# EAGLE design audiopthboard (EAGLE 5.06)
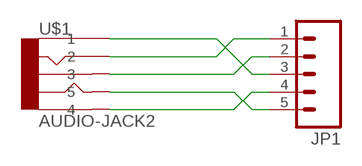
[diagram p0: schematic, sheet 1]

## Parts
JP1  M05LOCK  [1X05_LOCK]
U$1  AUDIO-JACK2  [AUDIO-JACK]

## Nets
N$1: JP1.1 U$1.2
N$2: JP1.2 U$1.3
N$3: JP1.3 U$1.1
N$4: JP1.5 U$1.5
N$5: JP1.4 U$1.4

## Library data of the parts
JP1 = SparkFun:M05: Header 5 Standard 5-pin 0.1" header. Use with straight break away headers (SKU : PRT-00116), right angle break away headers (PRT-00553), swiss pins (PRT-00743), machine pins (PRT-00117), and female headers (PRT-00115). Molex polarized connector foot print use with SKU : PRT-08230 with associated crimp pins and housings.
U$1 = SparkFun:AUDIO-JACK2

## Board
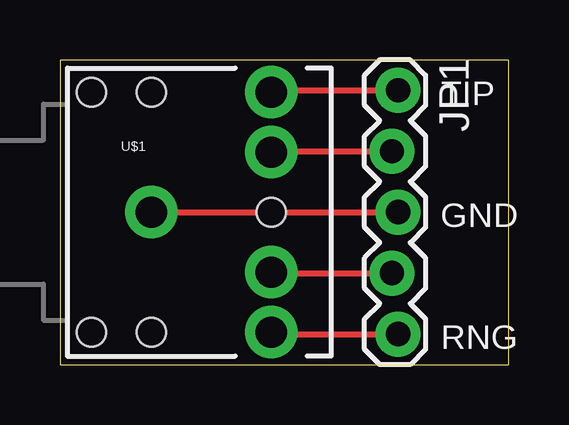
[diagram p1: board, top side]

Size 18.72 x 12.69 mm. Coordinates in mm from the lower left corner, seen from the top.
Outline: 0,0 18.72,0 18.72,12.69 0,12.69 0,0
Copper layers (1*16): Top 0.035mm / dielectric 1.5mm / Bottom 0.035mm
Design rules "default": minimum track width 10mil, minimum drill 24mil, track to track 8mil, track to pad 8mil, pad to pad 8mil, via to via 8mil, smd to smd 8mil, copper to edge 40mil, drill to drill 8mil, minimum pad ring 10mil, minimum via ring 8mil, stop-mask expansion 4mil, vias tented up to drill 0mil, thermal gap 10mil

### Footprints (pad centres in the part's own frame; a part is rotated, then mirrored left to right if it is on the bottom)
1X05_LOCK = drill 1.016 pad 1.88 round: 1 0,0.127; 2 2.54,-0.127; 3 5.08,0.127; 4 7.62,-0.127; 5 10.16,0.127
AUDIO-JACK = drill 1.3 pad 2.184 round: 1 0,0; 2 5,5; 3 5,2.5; 4 5,-2.5; 5 5,-5 | hole 1.2: 0,5; -2.5,5; -2.5,-5; 0,-5; 5,0

### Placement (x,y rotation side)
JP1  13.97,11.43 270 top
U$1  3.81,6.35 0 top

### Tracks (layer width: path | path; a pad name or v marks a point on that pad's centre or on a via)
N$1
  Top 0.254: JP1.1 8.89,11.43 U$1.2
N$2
  Top 0.254: JP1.2 8.89,8.89 U$1.3
N$3
  Top 0.254: U$1.1 JP1.3
N$4
  Top 0.254: JP1.5 8.89,1.27 U$1.5
N$5
  Top 0.254: JP1.4 8.89,3.81 U$1.4

### Text on the board
tPlace: TIP | GND | RNG